# Altium schematic sheet DIM.SchDoc
size A4; SheetNumber: 10; SheetTotal: 10
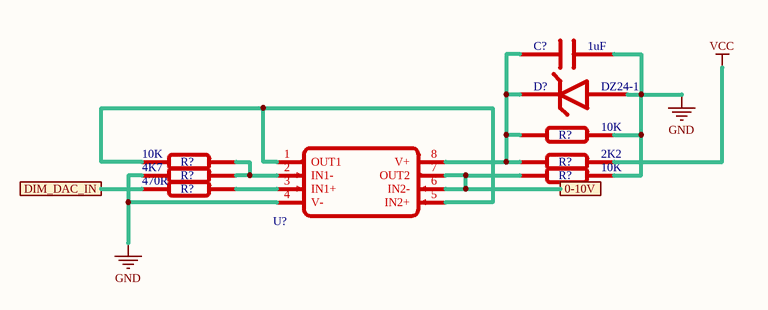
[diagram p0: DIM.SchDoc]

## Parts
(Parts that share a designator on the sheet are numbered #1, #2 ... from top to bottom, then left to right.)
C?  1uF  [C0402]
D?  DZ24-1  [Diode-Zener-0.5W]
R?#1  10K  [R0805]
R?#2  10K  [R0805]
R?#3  2K2  [R0805]
R?#4  4K7  [R0805]
R?#5  10K  [R0805]
R?#6  470R  [R0805]
U?  LM358  [SOIC-8]  (value not drawn)

## Ports
0-10V, DIM_DAC_IN

## Nets
GND: C?.2 D?.A R?#1.2 R?#4.1 R?#5.2 U?.4(V-)
VCC: R?#3.2
0-10V: R?#5.1 U?.6(IN2-) U?.7(OUT2) ; port 0-10V
DIM_DAC_IN: R?#6.1 ; port DIM_DAC_IN
NetC?_1: C?.1 D?.K R?#1.1 R?#3.1 U?.8(V+)
NetR?#2_1: R?#2.1 U?.1(OUT1) U?.5(IN2+)
NetR?#2_2: R?#2.2 R?#4.2 U?.2(IN1-)
NetR?#6_2: R?#6.2 U?.3(IN1+)

## Library data of the parts
C? = CAP-CER: Ceramic Capacitor
D? = Diode Zener: Zenner diodes
R?#1-R?#6 = Resistor
U? = LM358: Low-power dual Operational Amplifier; ComponentLink1Description: LM358M Datasheets; ComponentLink1URL: https://www.ti.com/general/docs/suppproductinfo.tsp?distId=10&gotoUrl=https%3A%2F%2Fwww.ti.com%2Flit%2Fgpn%2Flm158-n